# Altium schematic sheet TPS54331.SchDoc
size A4
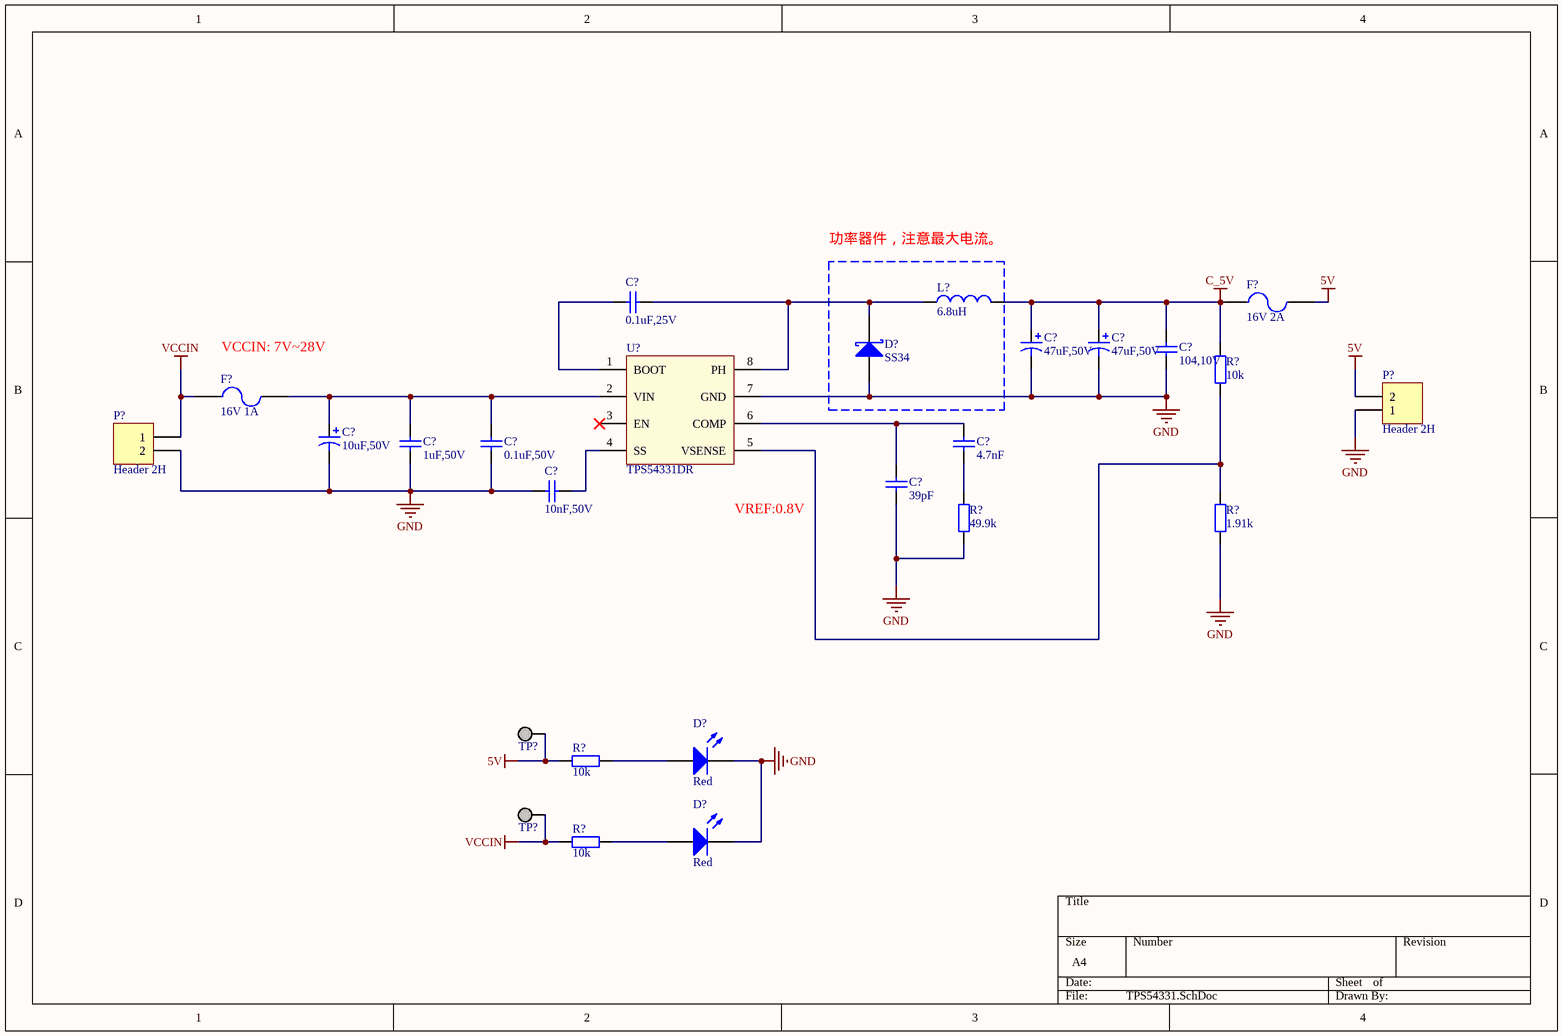
[diagram p0: TPS54331.SchDoc]

## Parts
(Parts that share a designator on the sheet are numbered #1, #2 ... from top to bottom, then left to right.)
C?#1  value 0.1uF,25V  [0603_C]  (hidden comment: Cap)
C?#2  value 47uF,50V  [AL-C-10X10.5]  (hidden comment: Cap_pol)
C?#3  value 47uF,50V  [AL-C-10X10.5]  (hidden comment: Cap_pol)
C?#4  value 104,10V  [1206_C]  (hidden comment: Cap)
C?#5  value 10uF,50V  [AL-C-10X10.5]  (hidden comment: Cap_pol)
C?#6  value 1uF,50V  [0603_C]  (hidden comment: Cap)
C?#7  value 0.1uF,50V  [0603_C]  (hidden comment: Cap)
C?#8  4.7nF  [0603_C]
C?#9  value 10nF,50V  [0603_C]  (hidden comment: Cap)
C?#10  39pF  [0603_C]
D?#1  value SS34  [DO-214AC]  (hidden comment: Diode Schottky)
D?#2  value Red  [0805_LED]  (hidden comment: LED)
D?#3  value Red  [0805_LED]  (hidden comment: LED)
F?#1  16V 2A  [PTC-1812]
F?#2  16V 1A  [PTC-1812]
L?  6.8uH  [6045_L]
P?#1  Header 2H  [KF2EDGK3.50H-2P]
P?#2  Header 2H  [KF2EDGK3.50H-2P]
R?#1  value 10k  [0603_R]  (hidden comment: Res)
R?#2  49.9k  [0603_R]
R?#3  1.91k  [0603_R]
R?#4  value 10k  [0603_R]  (hidden comment: Res)
R?#5  value 10k  [0603_R]  (hidden comment: Res)
TP?#1  TP  [TP_H]  (value not drawn)  (no BOM)
TP?#2  TP  [TP_H]  (value not drawn)  (no BOM)
U?  TPS54331DR  [SOIC8E]

## Blocks framed on the sheet
功率器件，注意最大电流。: D?#1 L?

## Nets
5V: F?#1.2 P?#2.2 R?#4.2 TP?#1.1
C_5V: C?#2.1 C?#3.1 C?#4.2 F?#1.1 L?.2 R?#1.2
GND: C?#2.2 C?#3.2 C?#4.1 C?#5.2 C?#6.1 C?#7.1 C?#9.2 C?#10.1 D?#1.1(A) D?#2.2(K) D?#3.2(K) P?#1.2 P?#2.1 R?#2.1 R?#3.1 U?.7(GND)
VCCIN: F?#2.1 P?#1.1 R?#5.2 TP?#2.1
NetC?#1_1: C?#1.1 D?#1.2(K) L?.1 U?.8(PH)
NetC?#1_2: C?#1.2 U?.1(BOOT)
NetC?#5_1: C?#5.1 C?#6.2 C?#7.2 F?#2.2 U?.2(VIN)
NetC?#8_1: C?#8.1 R?#2.2
NetC?#8_2: C?#8.2 C?#10.2 U?.6(COMP)
NetC?#9_1: C?#9.1 U?.4(SS)
NetD?#2_1: D?#2.1(A) R?#4.1
NetD?#3_1: D?#3.1(A) R?#5.1
NetR?#1_1: R?#1.1 R?#3.2 U?.5(VSENSE)

Not connected (* = marked no-connect by the designer): U? 3(EN)*

## Notes on the sheet
- (near F?#2) VCCIN: 7V~28V
- (near U?) VREF:0.8V

## Library data of the parts
C?#1 C?#7 = T_Cap_0603_0.1uF_25V_X5R: 贴片电容; Part Typer: X5R; Solder: SMD; Withstand Voltage: 25V; Tolerance: 10%; Schematic Path: X:\Database\Schematic Library.Schlib; Part Number: T_Cap_0603_0.1uF_25V_X5R; LibRef: T_Cap_0603_0.1uF_25V_X5R
C?#2 C?#3 C?#5 = T_Cap_AL10-10.5_470uF_25V: 贴片电解电容; Solder: SMD; Withstand Voltage: 25V; Tolerance: 20%; Schematic Path: X:\Database\Schematic Library.Schlib; ComponentLink1Description: 供应商链接; ComponentLink1URL: http://www.szlcsc.com/product/details_16815.html; Package: 3528; Supplier: LC; SuppliersPartNumber: C16133; Part Number: T_Cap_AL10-10.5_470uF_25V; LibRef: T_Cap_AL10-10.5_470uF_25V
C?#4 = T_Cap_1206_47uF_10V_X5R: 贴片电容; Part Typer: X5R; Solder: SMD; Withstand Voltage: 10V; Tolerance: 10%; Schematic Path: X:\Database\Schematic Library.Schlib; Part Number: T_Cap_1206_47uF_10V_X5R; LibRef: T_Cap_1206_47uF_10V_X5R
C?#6 = T_Cap_0603_10uF_16V_X5R: 贴片电容; Part Typer: X5R; Solder: SMD; Withstand Voltage: 16V; Tolerance: 10%; Schematic Path: X:\Database\Schematic Library.Schlib; Part Number: T_Cap_0603_10uF_16V_X5R; LibRef: T_Cap_0603_10uF_16V_X5R
C?#8 C?#10 = Cap
C?#9 = T_Cap_0603_10nF_50V_X7R: 贴片电容; Part Typer: X7R; Solder: SMD; Withstand Voltage: 50V; Tolerance: 10%; Schematic Path: X:\Database\Schematic Library.Schlib; Part Number: T_Cap_0603_10nF_50V_X7R; LibRef: T_Cap_0603_10nF_50V_X7R
D?#1 = T_SS34: 肖特基二极管; Part Number: T_SS34; Solder: SMD; Schematic Path: X:\Database\Schematic Library.Schlib; LibRef: T_SS34
D?#2 D?#3 = T_LED_Red_0805: 红色LED灯; Solder: SMD; Schematic Path: X:\Database\Schematic Library.Schlib; Part Number: T_LED_Red_0805; LibRef: T_LED_Red_0805
F?#1 F?#2 = Fuse
L? = Inductor
P?#1 P?#2 = Header 2H: Header, 2-Pin, Right Angle; LatestRevisionDate: 17-Jul-2002; LatestRevisionNote: Re-released for DXP Platform.; Publisher: Altium Limited
R?#1 R?#4 R?#5 = T_Res_0603_10k_1%_1/10W: 贴片电阻; Solder: SMD; Power: 1/10W; Tolerance: 1%; Schematic Path: X:\Database\Schematic Library.Schlib; Part Number: T_Res_0603_10k_1%_1/10W; LibRef: T_Res_0603_10k_1%_1/10W
R?#2 R?#3 = Res
TP?#1 TP?#2 = T_TestPoint_H: 测试点_过孔; Solder: DIP; Schematic Path: X:\Database\Schematic Library.Schlib; Part Number: T_TestPoint_H; LibRef: T_TestPoint_H
U? = TPS54331: TI, 3A, 3.5-28V, Buck